# Altium schematic sheet SEARAY_Connector_B.SchDoc
size B; SheetNumber: 5; SheetTotal: 5
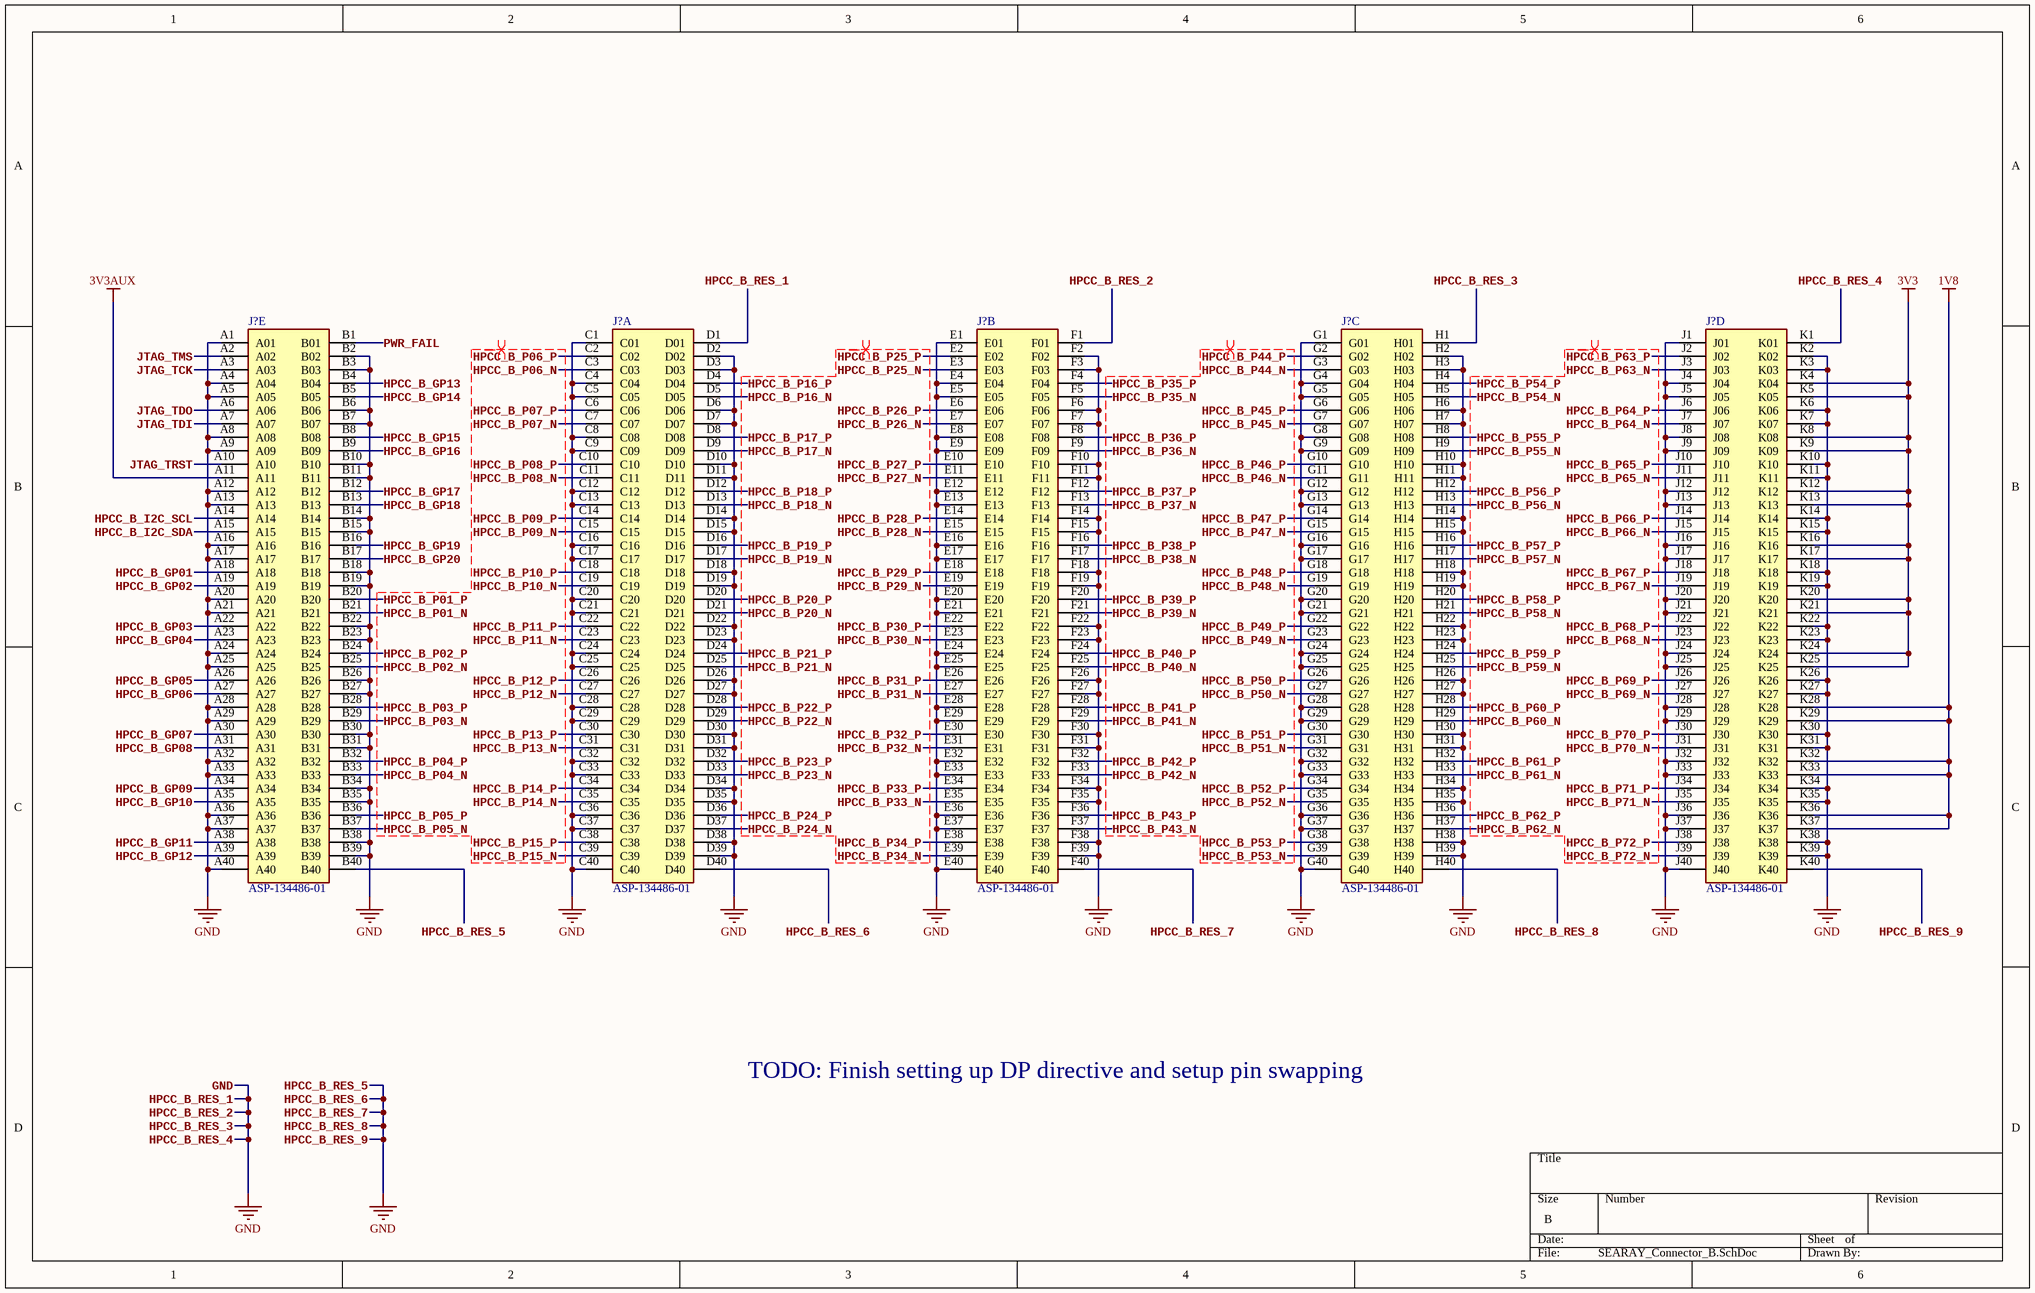
[diagram p0: SEARAY_Connector_B.SchDoc]

## Parts
(Parts that share a designator on the sheet are numbered #1, #2 ... from top to bottom, then left to right.)
J?#1  ASP-134486-01  [SAMTEC_ASP-134486-01]  (part E of 5)
J?#2  ASP-134486-01  [SAMTEC_ASP-134486-01]  (part A of 5)
J?#3  ASP-134486-01  [SAMTEC_ASP-134486-01]  (part B of 5)
J?#4  ASP-134486-01  [SAMTEC_ASP-134486-01]  (part C of 5)
J?#5  ASP-134486-01  [SAMTEC_ASP-134486-01]  (part D of 5)

## Nets
1V8: J?#5.K28 J?#5.K29 J?#5.K32 J?#5.K33 J?#5.K36 J?#5.K37
3V3: J?#5.K4(K04) J?#5.K5(K05) J?#5.K8(K08) J?#5.K9(K09) J?#5.K12 J?#5.K13 J?#5.K16 J?#5.K17 J?#5.K20 J?#5.K21 J?#5.K24 J?#5.K25
3V3AUX: J?#1.A11
GND: J?#1.A1(A01) J?#1.A4(A04) J?#1.A5(A05) J?#1.A8(A08) J?#1.A9(A09) J?#1.A12 J?#1.A13 J?#1.A16 J?#1.A17 J?#1.A20 J?#1.A21 J?#1.A24 J?#1.A25 J?#1.A28 J?#1.A29 J?#1.A32 J?#1.A33 J?#1.A36 J?#1.A37 J?#1.A40 J?#1.B2(B02) J?#1.B3(B03) J?#1.B6(B06) J?#1.B7(B07) J?#1.B10 J?#1.B11 J?#1.B14 J?#1.B15 J?#1.B18 J?#1.B19 J?#1.B22 J?#1.B23 J?#1.B26 J?#1.B27 J?#1.B30 J?#1.B31 J?#1.B34 J?#1.B35 J?#1.B38 J?#1.B39 J?#1.B40 J?#2.C1(C01) J?#2.C4(C04) J?#2.C5(C05) J?#2.C8(C08) J?#2.C9(C09) J?#2.C12 J?#2.C13 J?#2.C16 J?#2.C17 J?#2.C20 J?#2.C21 J?#2.C24 J?#2.C25 J?#2.C28 J?#2.C29 J?#2.C32 J?#2.C33 J?#2.C36 J?#2.C37 J?#2.C40 J?#2.D1(D01) J?#2.D2(D02) J?#2.D3(D03) J?#2.D6(D06) J?#2.D7(D07) J?#2.D10 J?#2.D11 J?#2.D14 J?#2.D15 J?#2.D18 J?#2.D19 J?#2.D22 J?#2.D23 J?#2.D26 J?#2.D27 J?#2.D30 J?#2.D31 J?#2.D34 J?#2.D35 J?#2.D38 J?#2.D39 J?#2.D40 J?#3.E1(E01) J?#3.E4(E04) J?#3.E5(E05) J?#3.E8(E08) J?#3.E9(E09) J?#3.E12 J?#3.E13 J?#3.E16 J?#3.E17 J?#3.E20 J?#3.E21 J?#3.E24 J?#3.E25 J?#3.E28 J?#3.E29 J?#3.E32 J?#3.E33 J?#3.E36 J?#3.E37 J?#3.E40 J?#3.F1(F01) J?#3.F2(F02) J?#3.F3(F03) J?#3.F6(F06) J?#3.F7(F07) J?#3.F10 J?#3.F11 J?#3.F14 J?#3.F15 J?#3.F18 J?#3.F19 J?#3.F22 J?#3.F23 J?#3.F26 J?#3.F27 J?#3.F30 J?#3.F31 J?#3.F34 J?#3.F35 J?#3.F38 J?#3.F39 J?#3.F40 J?#4.G1(G01) J?#4.G4(G04) J?#4.G5(G05) J?#4.G8(G08) J?#4.G9(G09) J?#4.G12 J?#4.G13 J?#4.G16 J?#4.G17 J?#4.G20 J?#4.G21 J?#4.G24 J?#4.G25 J?#4.G28 J?#4.G29 J?#4.G32 J?#4.G33 J?#4.G36 J?#4.G37 J?#4.G40 J?#4.H1(H01) J?#4.H2(H02) J?#4.H3(H03) J?#4.H6(H06) J?#4.H7(H07) J?#4.H10 J?#4.H11 J?#4.H14 J?#4.H15 J?#4.H18 J?#4.H19 J?#4.H22 J?#4.H23 J?#4.H26 J?#4.H27 J?#4.H30 J?#4.H31 J?#4.H34 J?#4.H35 J?#4.H38 J?#4.H39 J?#4.H40 J?#5.J1(J01) J?#5.J4(J04) J?#5.J5(J05) J?#5.J8(J08) J?#5.J9(J09) J?#5.J12 J?#5.J13 J?#5.J16 J?#5.J17 J?#5.J20 J?#5.J21 J?#5.J24 J?#5.J25 J?#5.J28 J?#5.J29 J?#5.J32 J?#5.J33 J?#5.J36 J?#5.J37 J?#5.J40 J?#5.K1(K01) J?#5.K2(K02) J?#5.K3(K03) J?#5.K6(K06) J?#5.K7(K07) J?#5.K10 J?#5.K11 J?#5.K14 J?#5.K15 J?#5.K18 J?#5.K19 J?#5.K22 J?#5.K23 J?#5.K26 J?#5.K27 J?#5.K30 J?#5.K31 J?#5.K34 J?#5.K35 J?#5.K38 J?#5.K39 J?#5.K40  [also labelled HPCC_B_RES_1, HPCC_B_RES_2, HPCC_B_RES_3, HPCC_B_RES_4, HPCC_B_RES_5, HPCC_B_RES_6, HPCC_B_RES_7, HPCC_B_RES_8, HPCC_B_RES_9]
HPCC_B_GP01: J?#1.A18
HPCC_B_GP02: J?#1.A19
HPCC_B_GP03: J?#1.A22
HPCC_B_GP04: J?#1.A23
HPCC_B_GP05: J?#1.A26
HPCC_B_GP06: J?#1.A27
HPCC_B_GP07: J?#1.A30
HPCC_B_GP08: J?#1.A31
HPCC_B_GP09: J?#1.A34
HPCC_B_GP10: J?#1.A35
HPCC_B_GP11: J?#1.A38
HPCC_B_GP12: J?#1.A39
HPCC_B_GP13: J?#1.B4(B04)
HPCC_B_GP14: J?#1.B5(B05)
HPCC_B_GP15: J?#1.B8(B08)
HPCC_B_GP16: J?#1.B9(B09)
HPCC_B_GP17: J?#1.B12
HPCC_B_GP18: J?#1.B13
HPCC_B_GP19: J?#1.B16
HPCC_B_GP20: J?#1.B17
HPCC_B_I2C_SCL: J?#1.A14
HPCC_B_I2C_SDA: J?#1.A15
HPCC_B_P01_N: J?#1.B21
HPCC_B_P01_P: J?#1.B20
HPCC_B_P02_N: J?#1.B25
HPCC_B_P02_P: J?#1.B24
HPCC_B_P03_N: J?#1.B29
HPCC_B_P03_P: J?#1.B28
HPCC_B_P04_N: J?#1.B33
HPCC_B_P04_P: J?#1.B32
HPCC_B_P05_N: J?#1.B37
HPCC_B_P05_P: J?#1.B36
HPCC_B_P06_N: J?#2.C3(C03)
HPCC_B_P06_P: J?#2.C2(C02)
HPCC_B_P07_N: J?#2.C7(C07)
HPCC_B_P07_P: J?#2.C6(C06)
HPCC_B_P08_N: J?#2.C11
HPCC_B_P08_P: J?#2.C10
HPCC_B_P09_N: J?#2.C15
HPCC_B_P09_P: J?#2.C14
HPCC_B_P10_N: J?#2.C19
HPCC_B_P10_P: J?#2.C18
HPCC_B_P11_N: J?#2.C23
HPCC_B_P11_P: J?#2.C22
HPCC_B_P12_N: J?#2.C27
HPCC_B_P12_P: J?#2.C26
HPCC_B_P13_N: J?#2.C31
HPCC_B_P13_P: J?#2.C30
HPCC_B_P14_N: J?#2.C35
HPCC_B_P14_P: J?#2.C34
HPCC_B_P15_N: J?#2.C39
HPCC_B_P15_P: J?#2.C38
HPCC_B_P16_N: J?#2.D5(D05)
HPCC_B_P16_P: J?#2.D4(D04)
HPCC_B_P17_N: J?#2.D9(D09)
HPCC_B_P17_P: J?#2.D8(D08)
HPCC_B_P18_N: J?#2.D13
HPCC_B_P18_P: J?#2.D12
HPCC_B_P19_N: J?#2.D17
HPCC_B_P19_P: J?#2.D16
HPCC_B_P20_N: J?#2.D21
HPCC_B_P20_P: J?#2.D20
HPCC_B_P21_N: J?#2.D25
HPCC_B_P21_P: J?#2.D24
HPCC_B_P22_N: J?#2.D29
HPCC_B_P22_P: J?#2.D28
HPCC_B_P23_N: J?#2.D33
HPCC_B_P23_P: J?#2.D32
HPCC_B_P24_N: J?#2.D37
HPCC_B_P24_P: J?#2.D36
HPCC_B_P25_N: J?#3.E3(E03)
HPCC_B_P25_P: J?#3.E2(E02)
HPCC_B_P26_N: J?#3.E7(E07)
HPCC_B_P26_P: J?#3.E6(E06)
HPCC_B_P27_N: J?#3.E11
HPCC_B_P27_P: J?#3.E10
HPCC_B_P28_N: J?#3.E15
HPCC_B_P28_P: J?#3.E14
HPCC_B_P29_N: J?#3.E19
HPCC_B_P29_P: J?#3.E18
HPCC_B_P30_N: J?#3.E23
HPCC_B_P30_P: J?#3.E22
HPCC_B_P31_N: J?#3.E27
HPCC_B_P31_P: J?#3.E26
HPCC_B_P32_N: J?#3.E31
HPCC_B_P32_P: J?#3.E30
HPCC_B_P33_N: J?#3.E35
HPCC_B_P33_P: J?#3.E34
HPCC_B_P34_N: J?#3.E39
HPCC_B_P34_P: J?#3.E38
HPCC_B_P35_N: J?#3.F5(F05)
HPCC_B_P35_P: J?#3.F4(F04)
HPCC_B_P36_N: J?#3.F9(F09)
HPCC_B_P36_P: J?#3.F8(F08)
HPCC_B_P37_N: J?#3.F13
HPCC_B_P37_P: J?#3.F12
HPCC_B_P38_N: J?#3.F17
HPCC_B_P38_P: J?#3.F16
HPCC_B_P39_N: J?#3.F21
HPCC_B_P39_P: J?#3.F20
HPCC_B_P40_N: J?#3.F25
HPCC_B_P40_P: J?#3.F24
HPCC_B_P41_N: J?#3.F29
HPCC_B_P41_P: J?#3.F28
HPCC_B_P42_N: J?#3.F33
HPCC_B_P42_P: J?#3.F32
HPCC_B_P43_N: J?#3.F37
HPCC_B_P43_P: J?#3.F36
HPCC_B_P44_N: J?#4.G3(G03)
HPCC_B_P44_P: J?#4.G2(G02)
HPCC_B_P45_N: J?#4.G7(G07)
HPCC_B_P45_P: J?#4.G6(G06)
HPCC_B_P46_N: J?#4.G11
HPCC_B_P46_P: J?#4.G10
HPCC_B_P47_N: J?#4.G15
HPCC_B_P47_P: J?#4.G14
HPCC_B_P48_N: J?#4.G19
HPCC_B_P48_P: J?#4.G18
HPCC_B_P49_N: J?#4.G23
HPCC_B_P49_P: J?#4.G22
HPCC_B_P50_N: J?#4.G27
HPCC_B_P50_P: J?#4.G26
HPCC_B_P51_N: J?#4.G31
HPCC_B_P51_P: J?#4.G30
HPCC_B_P52_N: J?#4.G35
HPCC_B_P52_P: J?#4.G34
HPCC_B_P53_N: J?#4.G39
HPCC_B_P53_P: J?#4.G38
HPCC_B_P54_N: J?#4.H5(H05)
HPCC_B_P54_P: J?#4.H4(H04)
HPCC_B_P55_N: J?#4.H9(H09)
HPCC_B_P55_P: J?#4.H8(H08)
HPCC_B_P56_N: J?#4.H13
HPCC_B_P56_P: J?#4.H12
HPCC_B_P57_N: J?#4.H17
HPCC_B_P57_P: J?#4.H16
HPCC_B_P58_N: J?#4.H21
HPCC_B_P58_P: J?#4.H20
HPCC_B_P59_N: J?#4.H25
HPCC_B_P59_P: J?#4.H24
HPCC_B_P60_N: J?#4.H29
HPCC_B_P60_P: J?#4.H28
HPCC_B_P61_N: J?#4.H33
HPCC_B_P61_P: J?#4.H32
HPCC_B_P62_N: J?#4.H37
HPCC_B_P62_P: J?#4.H36
HPCC_B_P63_N: J?#5.J3(J03)
HPCC_B_P63_P: J?#5.J2(J02)
HPCC_B_P64_N: J?#5.J7(J07)
HPCC_B_P64_P: J?#5.J6(J06)
HPCC_B_P65_N: J?#5.J11
HPCC_B_P65_P: J?#5.J10
HPCC_B_P66_N: J?#5.J15
HPCC_B_P66_P: J?#5.J14
HPCC_B_P67_N: J?#5.J19
HPCC_B_P67_P: J?#5.J18
HPCC_B_P68_N: J?#5.J23
HPCC_B_P68_P: J?#5.J22
HPCC_B_P69_N: J?#5.J27
HPCC_B_P69_P: J?#5.J26
HPCC_B_P70_N: J?#5.J31
HPCC_B_P70_P: J?#5.J30
HPCC_B_P71_N: J?#5.J35
HPCC_B_P71_P: J?#5.J34
HPCC_B_P72_N: J?#5.J39
HPCC_B_P72_P: J?#5.J38
JTAG_TCK: J?#1.A3(A03)
JTAG_TDI: J?#1.A7(A07)
JTAG_TDO: J?#1.A6(A06)
JTAG_TMS: J?#1.A2(A02)
JTAG_TRST: J?#1.A10
PWR_FAIL: J?#1.B1(B01)

## Layout directives
differential pair: HPCC_B_P01_N, HPCC_B_P01_P, HPCC_B_P02_N, HPCC_B_P02_P, HPCC_B_P03_N, HPCC_B_P03_P, HPCC_B_P04_N, HPCC_B_P04_P, HPCC_B_P05_N, HPCC_B_P05_P, HPCC_B_P06_N, HPCC_B_P06_P, HPCC_B_P07_N, HPCC_B_P07_P, HPCC_B_P08_N, HPCC_B_P08_P, HPCC_B_P09_N, HPCC_B_P09_P, HPCC_B_P10_N, HPCC_B_P10_P, HPCC_B_P11_N, HPCC_B_P11_P, HPCC_B_P12_N, HPCC_B_P12_P, HPCC_B_P13_N, HPCC_B_P13_P, HPCC_B_P14_N, HPCC_B_P14_P, HPCC_B_P15_N, HPCC_B_P15_P, HPCC_B_P16_N, HPCC_B_P16_P, HPCC_B_P17_N, HPCC_B_P17_P, HPCC_B_P18_N, HPCC_B_P18_P, HPCC_B_P19_N, HPCC_B_P19_P, HPCC_B_P20_N, HPCC_B_P20_P, HPCC_B_P21_N, HPCC_B_P21_P, HPCC_B_P22_N, HPCC_B_P22_P, HPCC_B_P23_N, HPCC_B_P23_P, HPCC_B_P24_N, HPCC_B_P24_P, HPCC_B_P25_N, HPCC_B_P25_P, HPCC_B_P26_N, HPCC_B_P26_P, HPCC_B_P27_N, HPCC_B_P27_P, HPCC_B_P28_N, HPCC_B_P28_P, HPCC_B_P29_N, HPCC_B_P29_P, HPCC_B_P30_N, HPCC_B_P30_P, HPCC_B_P31_N, HPCC_B_P31_P, HPCC_B_P32_N, HPCC_B_P32_P, HPCC_B_P33_N, HPCC_B_P33_P, HPCC_B_P34_N, HPCC_B_P34_P, HPCC_B_P35_N, HPCC_B_P35_P, HPCC_B_P36_N, HPCC_B_P36_P, HPCC_B_P37_N, HPCC_B_P37_P, HPCC_B_P38_N, HPCC_B_P38_P, HPCC_B_P39_N, HPCC_B_P39_P, HPCC_B_P40_N, HPCC_B_P40_P, HPCC_B_P41_N, HPCC_B_P41_P, HPCC_B_P42_N, HPCC_B_P42_P, HPCC_B_P43_N, HPCC_B_P43_P, HPCC_B_P44_N, HPCC_B_P44_P, HPCC_B_P45_N, HPCC_B_P45_P, HPCC_B_P46_N, HPCC_B_P46_P, HPCC_B_P47_N, HPCC_B_P47_P, HPCC_B_P48_N, HPCC_B_P48_P, HPCC_B_P49_N, HPCC_B_P49_P, HPCC_B_P50_N, HPCC_B_P50_P, HPCC_B_P51_N, HPCC_B_P51_P, HPCC_B_P52_N, HPCC_B_P52_P, HPCC_B_P53_N, HPCC_B_P53_P, HPCC_B_P54_N, HPCC_B_P54_P, HPCC_B_P55_N, HPCC_B_P55_P, HPCC_B_P56_N, HPCC_B_P56_P, HPCC_B_P57_N, HPCC_B_P57_P, HPCC_B_P58_N, HPCC_B_P58_P, HPCC_B_P59_N, HPCC_B_P59_P, HPCC_B_P60_N, HPCC_B_P60_P, HPCC_B_P61_N, HPCC_B_P61_P, HPCC_B_P62_N, HPCC_B_P62_P, HPCC_B_P63_N, HPCC_B_P63_P, HPCC_B_P64_N, HPCC_B_P64_P, HPCC_B_P65_N, HPCC_B_P65_P, HPCC_B_P66_N, HPCC_B_P66_P, HPCC_B_P67_N, HPCC_B_P67_P, HPCC_B_P68_N, HPCC_B_P68_P, HPCC_B_P69_N, HPCC_B_P69_P, HPCC_B_P70_N, HPCC_B_P70_P, HPCC_B_P71_N, HPCC_B_P71_P, HPCC_B_P72_N, HPCC_B_P72_P

## Notes on the sheet
- TODO: Finish setting up DP directive and setup pin swapping

## Library data of the parts
J?#1-J?#5 = ASP-134486-01: 400 Position Connector Array, Female Sockets Surface Mount Gold; MF: Samtec Inc.; Value: *; SnapEDA_Link: https://www.snapeda.com/parts/ASP-134486-01/Samtec/view-part/?ref=snap; Purchase-URL: https://pricing.snapeda.com/search/part/ASP-134486-01/?ref=eda; Availability: In Stock; Price: None; Package: None; Check_prices: https://www.snapeda.com/parts/ASP-134486-01/Samtec/view-part/?ref=eda; MP: ASP-134486-01